# Altium schematic sheet BOOT_JTAG_AUX.SchDoc: =project_title
size Tabloid; CompanyName: Luxonis Holding; Organization: Luxonis Holding; Address1: 1925 Harmony Park Drive; Address2: Westminster, CO; Address3: 80234; Address4: United States; SheetNumber: 9; SheetTotal: 12
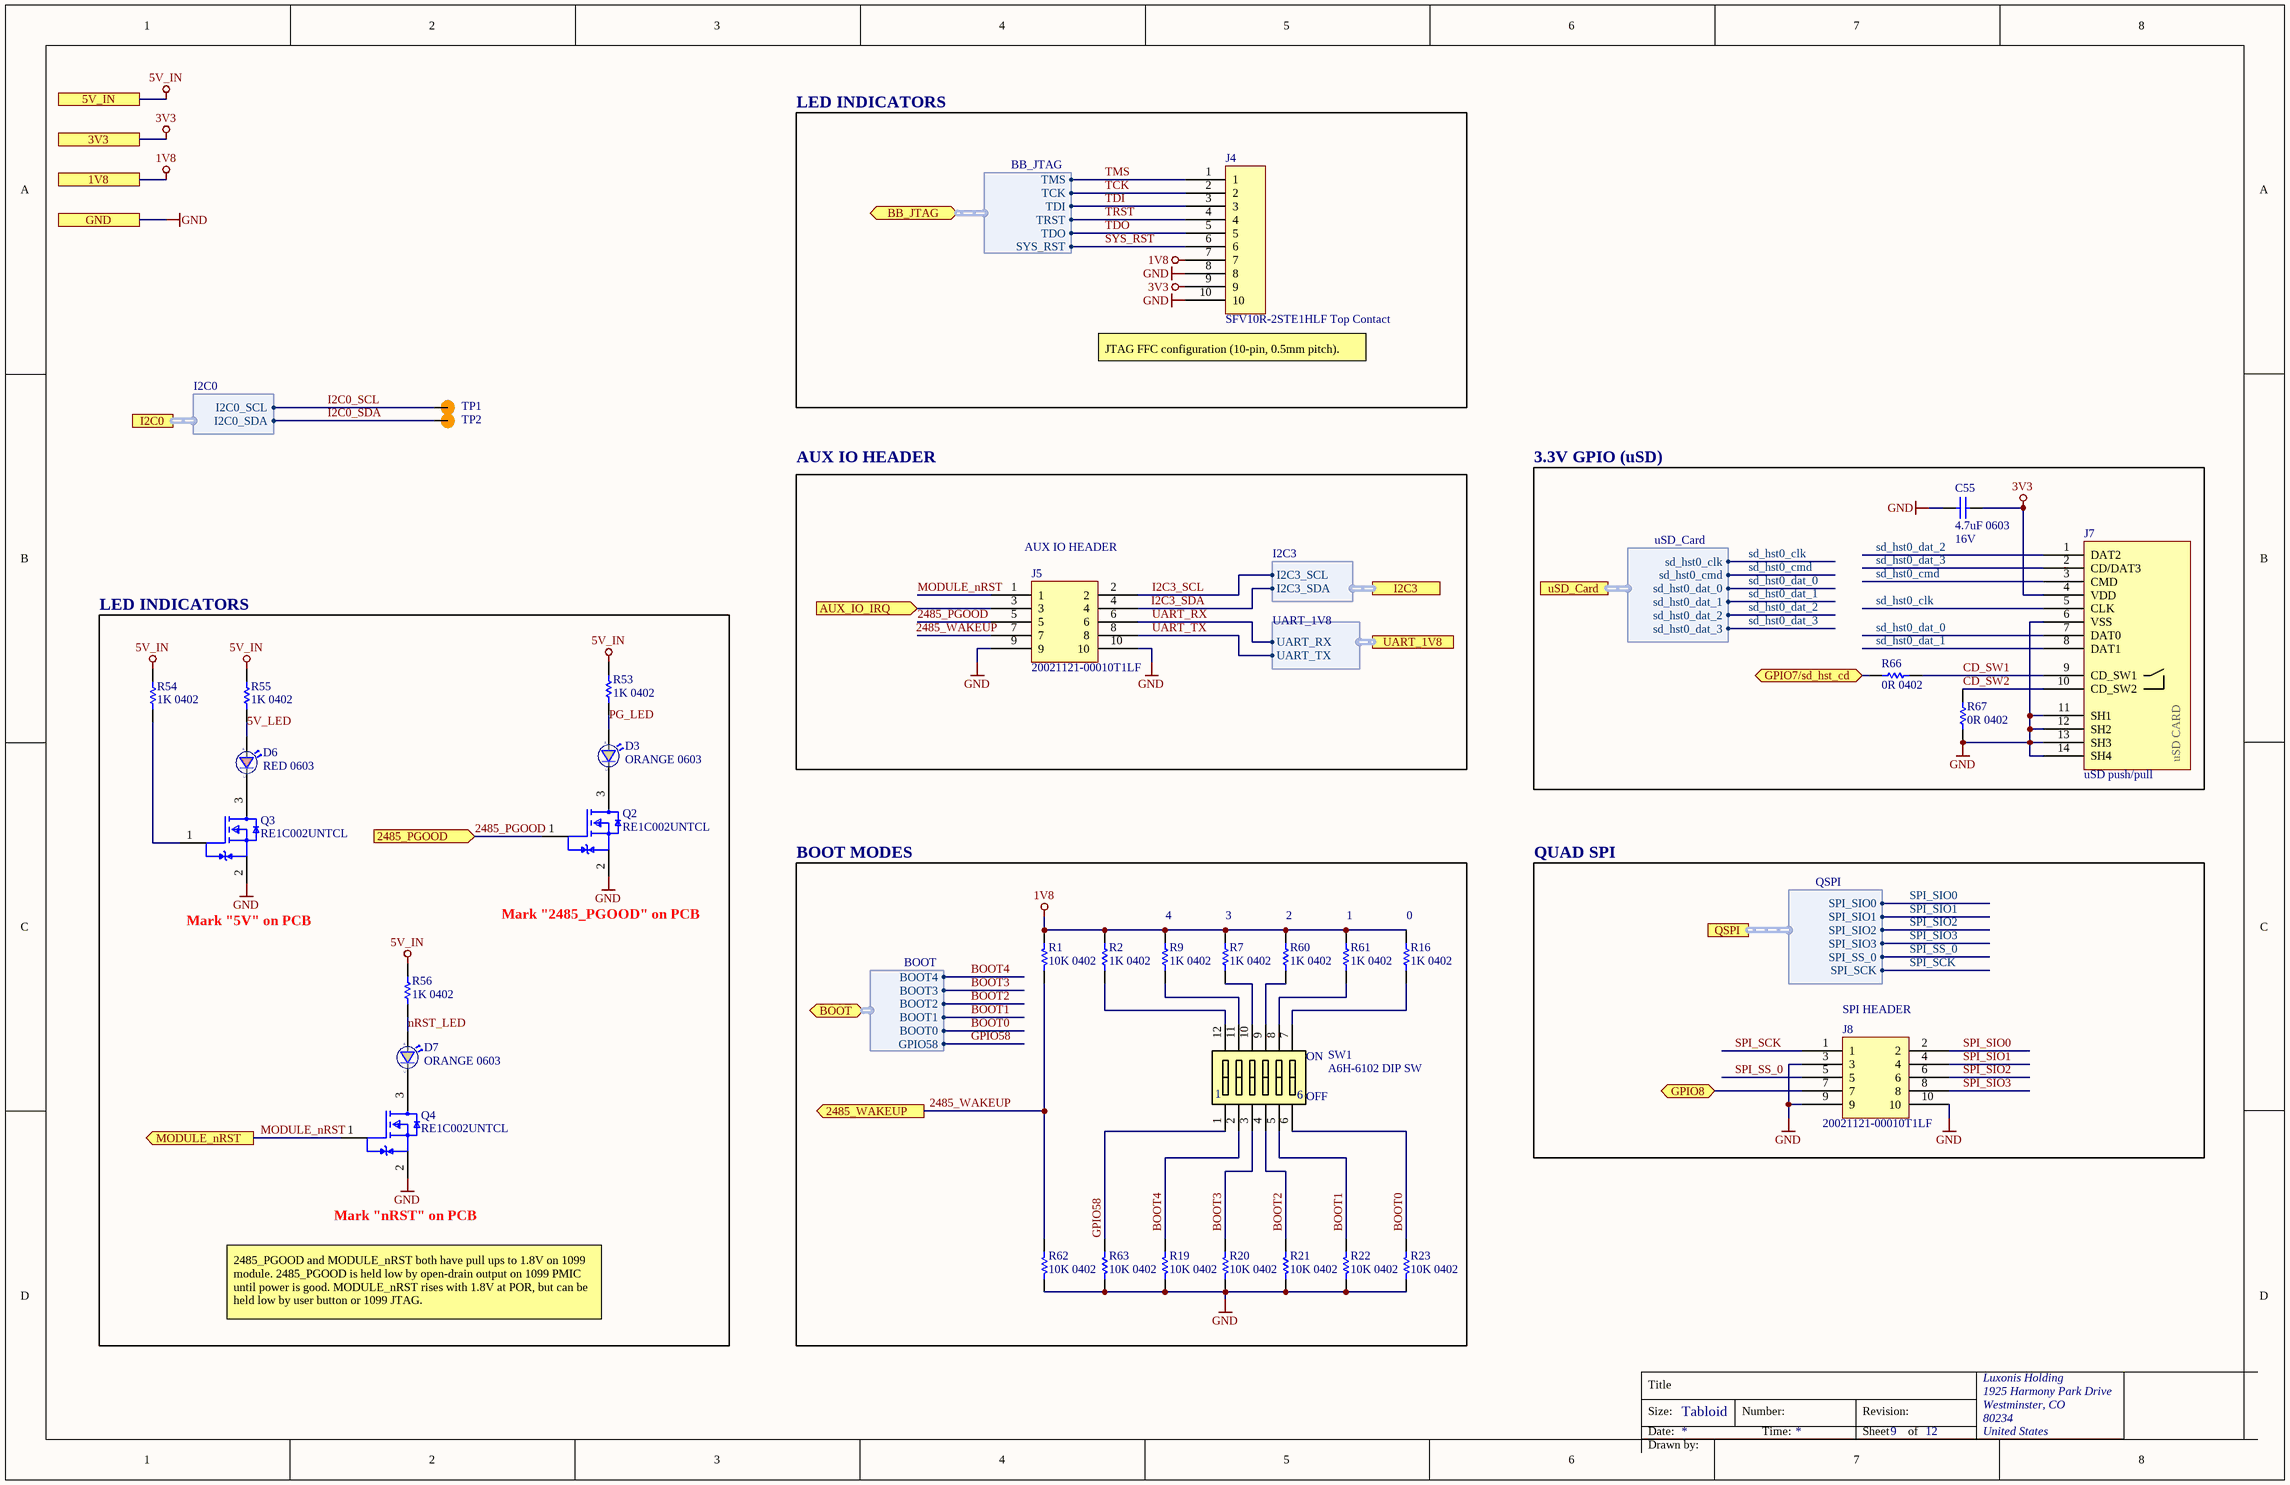
[diagram p0: BOOT_JTAG_AUX.SchDoc]

## Parts
C55  4.7uF 0603  Voltage Rating: 16V  [CAPC0603(1608)100_N]
D3  ORANGE 0603  [SML_D1xx8W]
D6  RED 0603  [SML_D1xx8W]
D7  ORANGE 0603  [SML_D1xx8W]
J4  SFV10R-2STE1HLF Top Contact  [SFV10R-2STE1HLF]
J5  20021121-00010T1LF  [20021121-00010T1LF]
J7  uSD push/pull  [104031-0811]
J8  20021121-00010T1LF  [20021121-00010T1LF]
Q2  RE1C002UNTCL  [RE1C002UNTCL]
Q3  RE1C002UNTCL  [RE1C002UNTCL]
Q4  RE1C002UNTCL  [RE1C002UNTCL]
R1  10K 0402  [RESC0402(1005)_N]
R2  1K 0402  [RESC0402(1005)_N]
R7  1K 0402  [RESC0402(1005)_N]
R9  1K 0402  [RESC0402(1005)_N]
R16  1K 0402  [RESC0402(1005)_N]
R19  10K 0402  [RESC0402(1005)_N]
R20  10K 0402  [RESC0402(1005)_N]
R21  10K 0402  [RESC0402(1005)_N]
R22  10K 0402  [RESC0402(1005)_N]
R23  10K 0402  [RESC0402(1005)_N]
R53  1K 0402  [RESC0402(1005)_N]
R54  1K 0402  [RESC0402(1005)_N]
R55  1K 0402  [RESC0402(1005)_N]
R56  1K 0402  [RESC0402(1005)_N]
R60  1K 0402  [RESC0402(1005)_N]
R61  1K 0402  [RESC0402(1005)_N]
R62  10K 0402  [RESC0402(1005)_N]
R63  10K 0402  [RESC0402(1005)_N]
R66  0R 0402  [RESC0402(1005)_N]
R67  0R 0402  [RESC0402(1005)_N]
SW1  A6H-6102 DIP SW  [A6H-610x]
TP1  TP100_200_NS  [TP100_200_NS]  (value not drawn)  (no BOM)
TP2  TP100_200_NS  [TP100_200_NS]  (value not drawn)  (no BOM)

## Blocks framed on the sheet
LED INDICATORS: J4
AUX IO HEADER: J5
3.3V GPIO (uSD): C55 J7 R66 R67
LED INDICATORS: D3 D6 D7 Q2-Q4 R53-R56
BOOT MODES: R1 R2 R7 R9 R16 R19-R23 R60-R63 SW1
QUAD SPI: J8

## Ports
1V8, 3V3, 5V_IN, 2485_PGOOD (in), 2485_WAKEUP (out), AUX_IO_IRQ (in), BB_JTAG (bidir, harness BB_JTAG), BOOT (bidir, harness BOOT), GND, GPIO7/sd_hst_cd (bidir), GPIO8 (bidir), I2C0 (harness I2C0), I2C3 (harness I2C3), MODULE_nRST (out), QSPI (harness QSPI), UART_1V8 (harness UART_1V8), uSD_Card (harness uSD_Card)

## Harnesses
BOOT: BOOT4, BOOT3, BOOT2, BOOT1, BOOT0, GPIO58
BB_JTAG: TMS, TCK, TDI, TRST, TDO, SYS_RST
I2C3: I2C3_SDA, I2C3_SCL
QSPI: SPI_SCK, SPI_SIO0, SPI_SIO1, SPI_SIO2, SPI_SIO3, SPI_SS_0
uSD_Card: sd_hst0_clk, sd_hst0_cmd, sd_hst0_dat_0, sd_hst0_dat_1, sd_hst0_dat_2, sd_hst0_dat_3
UART_1V8: UART_RX, UART_TX
I2C0: I2C0_SDA, I2C0_SCL

## Nets
1V8: J4.7 R1.1 R2.2 R7.2 R9.2 R16.2 R60.2 R61.2 ; port 1V8
3V3: C55.2 J4.9 J7.4(VDD) ; port 3V3
5V_IN: R53.2 R54.2 R55.2 R56.2 ; port 5V_IN
GND: C55.1 J4.8 J4.10 J5.9 J5.10 J7.6(VSS) J7.11(SH1) J7.12(SH2) J7.13(SH3) J7.14(SH4) J8.3 J8.9 J8.10 Q2.2(Source) Q3.2(Source) Q4.2(Source) R19.2 R20.2 R21.2 R22.2 R23.2 R62.2 R63.2 R67.1 ; port GND
5V_LED: D6.2(A) R55.1
2485_PGOOD: J5.5 Q2.1(Gate) ; port 2485_PGOOD
2485_WAKEUP: R1.2 R62.1 ; port 2485_WAKEUP
AUX_IO_IRQ: J5.3 ; port AUX_IO_IRQ
BOOT0: R23.1 SW1.6 ; port BOOT.BOOT0
BOOT1: R22.1 SW1.5 ; port BOOT.BOOT1
BOOT2: R21.1 SW1.4 ; port BOOT.BOOT2
BOOT3: R20.1 SW1.3 ; port BOOT.BOOT3
BOOT4: R19.1 SW1.2 ; port BOOT.BOOT4
CD_SW1: J7.9(CD_SW1) R66.1
CD_SW2: J7.10(CD_SW2) R67.2
GPIO7/sd_hst_cd: R66.2 ; port GPIO7/sd_hst_cd
GPIO8: J8.7 ; port GPIO8
GPIO58: R63.1 SW1.1 ; port BOOT.GPIO58
I2C0_SCL: TP1.1 ; port I2C0.I2C0_SCL
I2C0_SDA: TP2.1 ; port I2C0.I2C0_SDA
I2C3_SCL: J5.2 ; port I2C3.I2C3_SCL
I2C3_SDA: J5.4 ; port I2C3.I2C3_SDA
MODULE_nRST: J5.1 Q4.1(Gate) ; port MODULE_nRST
nRST_LED: D7.2(A) R56.1
PG_LED: D3.2(A) R53.1
sd_hst0_clk: J7.5(CLK) ; port uSD_Card.sd_hst0_clk
sd_hst0_cmd: J7.3(CMD) ; port uSD_Card.sd_hst0_cmd
sd_hst0_dat_0: J7.7(DAT0) ; port uSD_Card.sd_hst0_dat_0
sd_hst0_dat_1: J7.8(DAT1) ; port uSD_Card.sd_hst0_dat_1
sd_hst0_dat_2: J7.1(DAT2) ; port uSD_Card.sd_hst0_dat_2
sd_hst0_dat_3: J7.2(CD/DAT3) ; port uSD_Card.sd_hst0_dat_3
SPI_SCK: J8.1 ; port QSPI.SPI_SCK
SPI_SIO0: J8.2 ; port QSPI.SPI_SIO0
SPI_SIO1: J8.4 ; port QSPI.SPI_SIO1
SPI_SIO2: J8.6 ; port QSPI.SPI_SIO2
SPI_SIO3: J8.8 ; port QSPI.SPI_SIO3
SPI_SS_0: J8.5 ; port QSPI.SPI_SS_0
SYS_RST: J4.6 ; port BB_JTAG.SYS_RST
TCK: J4.2 ; port BB_JTAG.TCK
TDI: J4.3 ; port BB_JTAG.TDI
TDO: J4.5 ; port BB_JTAG.TDO
TMS: J4.1 ; port BB_JTAG.TMS
TRST: J4.4 ; port BB_JTAG.TRST
UART_RX: J5.6 ; port UART_1V8.UART_RX
UART_TX: J5.8 ; port UART_1V8.UART_TX
NetD3_1: D3.1(C) Q2.3(Drain)
NetD6_1: D6.1(C) Q3.3(Drain)
NetD7_1: D7.1(C) Q4.3(Drain)
NetQ3_1: Q3.1(Gate) R54.1
NetR2_1: R2.1 SW1.12
NetR7_1: R7.1 SW1.10
NetR9_1: R9.1 SW1.11
NetR16_1: R16.1 SW1.7
NetR60_1: R60.1 SW1.9
NetR61_1: R61.1 SW1.8

Not connected (* = marked no-connect by the designer): J5 7

## Notes on the sheet
- (near J4) JTAG FFC configuration (10-pin, 0.5mm pitch).
- (near J5) AUX IO HEADER
- Mark "5V" on PCB
- Mark "2485_PGOOD" on PCB
- (near R9) 4
- (near R7) 3
- (near R60) 2
- (near R61) 1
- (near R16) 0
- (near J8) SPI HEADER
- Mark "nRST" on PCB
- 2485_PGOOD and MODULE_nRST both have pull ups to 1.8V on 1099 module. 2485_PGOOD is held low by open-drain output on 1099 PMIC until power is good. MODULE_nRST rises with 1.8V at POR, but can be held low by user button or 1099 JTAG.
- Labels drawn without touching a wire or pin: 2485_WAKEUP
- Title
- Size:
- Date:
- Tabloid
- Number:
- Time:
- Revision:
- Sheet
- of
- Drawn by:
- (in symbol 104031-0811) uSD CARD
- (in symbol A6H-6102) ON; OFF

## Library data of the parts
C55 = GRM188R61C475KAAJD: CAP CER 4.7UF 16V X5R 0603 10%; Manufacturer 1: Murata; Material: Ceramic; Manufacturer Part Number 1: GRM188R61C475KAAJD; Supplier 1: Digi-Key; Stock 1: 455058; Pricing 1: 1=0.35000, 10=0.24600, 100=0.14730, 500=0.11050, 1000=0.09331 (USD); RoHS: Yes; Mount: Surface Mount; Case/Package: 0603; Weight: 0.000222oz; Case Code (Metric): 1608; Case Code (Imperial): 0603; Min Operating Temperature: -55°C; Max Operating Temperature: 85°C; Capacitance: 4.7uF; Tolerance: 10%; Packaging: Tape and Reel; Dielectric: X5R; Termination: SMD/SMT; Voltage Rating (DC): 16V; Package Quantity: 4000; Length: 1.6mm; Height: 0.8mm; Width: 0.8mm; Thickness: 0.037inch; Depth: 0.8mm; REACH SVHC: No SVHC; Lead Free: Lead Free; ComponentLink1URL: https://datasheet.ciiva.com/14813/595grm188r61c475kaaj23-14813668.pdf?src-supplier=Arrow; ComponentLink1Description: https://datasheet.ciiva.com/14813/595grm188r61c475kaaj23-14813668.pdf?src-supplier=Arrow; Supplier 2: Digi-Key; Manufacturer 2: Murata; Manufacturer Part Number 2: GRM188R61C475KAAJD; Stock 2: 455058; Pricing 2: 1=0.35000, 10=0.24600, 100=0.14730, 500=0.11050, 1000=0.09331 (USD); Supplier 3: Digi-Key; Manufacturer 3: Murata; Manufacturer Part Number 3: GRM188R61C475KAAJD; Stock 3: 452000; Pricing 3: 4000=0.07259, 8000=0.06832, 12000=0.06619, 28000=0.06405 (USD); Supplier Part Number 1: 490-10481-1-ND; Supplier Part Number 2: 490-10481-6-ND; Supplier Part Number 3: 490-10481-2-ND
D3 D7 = SML-D12D8WT86: LED ORANGE DIFFUSED 0603 SMD Orange 605nm LED Indication - Discrete 2.2V 0603 (1608 Metric); Manufacturer 1: Rohm; Lens Color: White; Lens Style: Diffused,Colorless,Rectangular; Number of LEDs: 1; Viewing Angle: 160°; Forward Current: 20mA; Luminous Intensity: 100mcd; Supplier 1: Digi-Key; Stock 1: 29355; Pricing 1: 1=0.33000, 10=0.23900, 100=0.11340, 500=0.07560, 1000=0.05922 (USD); RoHS: Yes; Mount: Surface Mount; Case/Package: 0603; Number of Pins: 2; Color: Orange; Case Code (Metric): 1608; Case Code (Imperial): 0603; Min Operating Temperature: -40°C; Max Operating Temperature: 85°C; Dominant Wavelength: 605nm; Forward Voltage: 2.2V; Package Quantity: 1; Packaging: Tape and Reel; Illumination Color: Orange; Test Current: 20mA; Lens Transparency: Diffused; Wavelength: 605nm; Length: 1.6mm; Height: 0.65mm; Width: 0.8mm; Radiation Hardening: No; REACH SVHC: Unknown; Lead Free: Lead Free; ComponentLink1URL: https://datasheet.ciiva.com/2115/sml-d1-2115577.pdf?src-supplier=Digi-Key; ComponentLink1Description: https://datasheet.ciiva.com/2115/sml-d1-2115577.pdf?src-supplier=Digi-Key; ComponentLink2URL: https://datasheet.ciiva.com/2115/sml-d1-2115578.pdf?src-supplier=Digi-Key; ComponentLink2Description: https://datasheet.ciiva.com/2115/sml-d1-2115578.pdf?src-supplier=Digi-Key; ComponentLink3URL: https://datasheet.ciiva.com/3161/sml-d1-3161418.pdf?src-supplier=Avnet; ComponentLink3Description: https://datasheet.ciiva.com/3161/sml-d1-3161418.pdf?src-supplier=Avnet; ComponentLink4URL: https://datasheet.ciiva.com/16387/sml-d1-16387850.pdf?src-supplier=Future+Electronics; ComponentLink4Description: https://datasheet.ciiva.com/16387/sml-d1-16387850.pdf?src-supplier=Future+Electronics; ComponentLink5URL: https://datasheet.ciiva.com/2115/sml-d1-2115579.pdf?src-supplier=Digi-Key; ComponentLink5Description: https://datasheet.ciiva.com/2115/sml-d1-2115579.pdf?src-supplier=Digi-Key; ComponentLink6URL: https://datasheet.ciiva.com/17419/sml-d1-17419886.pdf?src-supplier=Avnet+Europe; ComponentLink6Description: https://datasheet.ciiva.com/17419/sml-d1-17419886.pdf?src-supplier=Avnet+Europe; Supplier Part Number 1: 511-1577-1-ND; Manufacturer Part Number 1: SML-D12D8WT86
D6 = SML-D12U8WT86: LED RED DIFFUSED 0603 SMD Red 620nm LED Indication - Discrete 2.2V 0603 (1608 Metric); Manufacturer 1: Rohm; Lens Color: White,Clear,Diffused; Lens Style: Rectangular,Diffused,Colorless; Forward Current: 20mA; Luminous Intensity: 63mcd; Number of LEDs: 1; Viewing Angle: 160°; RoHS: Yes; Mount: Surface Mount; Case/Package: 0603; Number of Pins: 2; Color: Red; Case Code (Metric): 1608; Case Code (Imperial): 0603; Min Operating Temperature: -40°C; Max Operating Temperature: 85°C; Forward Voltage: 2.2V; Packaging: Tape and Reel; Dominant Wavelength: 620nm; Wavelength: 620nm; Package Quantity: 1; Illumination Color: Red; Test Current: 20mA; Lens Transparency: Diffused; Length: 1.6mm; Height: 0.65mm; Width: 0.8mm; Radiation Hardening: No; REACH SVHC: No SVHC; Lead Free: Lead Free; ComponentLink1URL: https://datasheet.ciiva.com/11774/0900766b80df3ada-11774020.pdf?src-supplier=RSComponents; ComponentLink1Description: https://datasheet.ciiva.com/11774/0900766b80df3ada-11774020.pdf?src-supplier=RSComponents; ComponentLink2URL: https://datasheet.ciiva.com/2110/sml-d1-2110375.pdf?src-supplier=Digi-Key; ComponentLink2Description: https://datasheet.ciiva.com/2110/sml-d1-2110375.pdf?src-supplier=Digi-Key; ComponentLink3URL: https://datasheet.ciiva.com/2110/sml-d1-2110376.pdf?src-supplier=Digi-Key; ComponentLink3Description: https://datasheet.ciiva.com/2110/sml-d1-2110376.pdf?src-supplier=Digi-Key; ComponentLink4URL: https://datasheet.ciiva.com/2110/sml-d1-2110377.pdf?src-supplier=Digi-Key; ComponentLink4Description: https://datasheet.ciiva.com/2110/sml-d1-2110377.pdf?src-supplier=Digi-Key; ComponentLink5URL: https://datasheet.ciiva.com/9324/sml-d1-9324826.pdf?src-supplier=Avnet; ComponentLink5Description: https://datasheet.ciiva.com/9324/sml-d1-9324826.pdf?src-supplier=Avnet; ComponentLink6URL: https://datasheet.ciiva.com/17420/sml-d1-17420939.pdf?src-supplier=Avnet+Europe; ComponentLink6Description: https://datasheet.ciiva.com/17420/sml-d1-17420939.pdf?src-supplier=Avnet+Europe; Supplier 1: Digi-Key; Manufacturer Part Number 1: SML-D12U8WT86; Stock 1: 63748; Pricing 1: 1=0.33000, 10=0.23900, 100=0.11340, 500=0.07560, 1000=0.05922 (USD); Supplier Part Number 1: 511-1580-1-ND
J4 = SFV10R-2STE1HLF: CONN FFC TOP 10POS 0.50MM R/A; Manufacturer 1: Amphenol FCI; Actuator Material: Glass,Polyphenylene; Number of Contacts: 10; Current Rating: 500mA; Voltage Rating: 50V; Contact Resistance: 30mR; Insulation Resistance: 100MR; Gender: Female; Wire/Cable Type: Straight; Pitch: 0.5mm; System: Connector; Supplier 1: Digi-Key; Manufacturer Part Number 1: SFV10R-2STE1HLF; Stock 1: 78727; Pricing 1: 1=0.63000, 10=0.59300, 25=0.53360, 50=0.47420, 100=0.45440, 250=0.41488, 500=0.39512, 1000=0.32597 (USD); RoHS: Yes; Mount: Surface Mount; Contact Material: Bronze; Contact Plating: Tin; Housing Color: Black; Housing Material: Polyamide; Min Operating Temperature: -55°C; Max Operating Temperature: 105°C; Number of Rows: 1; Termination: Solder; Orientation: Right Angle; Package Quantity: 1; Packaging: Tape and Reel; Contact Location: Top; Number of Positions: 10; Max Voltage Rating (AC): 50V; Max Voltage Rating (DC): 50V; Length: 10.5mm; Depth: 4.9mm; Radiation Hardening: No; Lead Free: Lead Free; Flammability Rating: UL94 V-0; ComponentLink1URL: https://datasheet.ciiva.com/672/10112793-672039.pdf?src-supplier=Digi-Key; ComponentLink1Description: https://datasheet.ciiva.com/672/10112793-672039.pdf?src-supplier=Digi-Key; ComponentLink2URL: https://datasheet.ciiva.com/672/10112793-672040.pdf?src-supplier=Digi-Key; ComponentLink2Description: https://datasheet.ciiva.com/672/10112793-672040.pdf?src-supplier=Digi-Key; ComponentLink3URL: https://datasheet.ciiva.com/672/10112793-672041.pdf?src-supplier=Digi-Key; ComponentLink3Description: https://datasheet.ciiva.com/672/10112793-672041.pdf?src-supplier=Digi-Key; ComponentLink4URL: https://datasheet.ciiva.com/10368/10112793-10368361.pdf?src-supplier=Avnet; ComponentLink4Description: https://datasheet.ciiva.com/10368/10112793-10368361.pdf?src-supplier=Avnet; Supplier Part Number 1: 609-4306-1-ND; Supplier 2: Mouser; Supplier Part Number 2: 649-SFV10R-2STE1HLF
J5 J8 = 20021121-00010T1LF: CONN HEADER SMD 10POS 1.27MM; Manufacturer 1: Amphenol FCI; Number of Contacts: 10; Contact Resistance: 30mR; Max Voltage Rating (AC): 125V; Connector Type: Male Pin; Row Spacing: 0.05inch; Supplier 1: Digi-Key; Manufacturer Part Number 1: 20021121-00010T1LF; Stock 1: 1465; Pricing 1: 1=0.77000, 10=0.71800, 100=0.55040, 500=0.47860, 1000=0.39485, 5000=0.34699, 10000=0.32306 (USD); RoHS: Yes; Mount: Surface Mount; Contact Plating: Gold; Color: Black; Contact Material: Copper Alloy; Housing Color: Black; Housing Material: Thermoplastic; Min Operating Temperature: -40°C; Max Operating Temperature: 85°C; Number of Rows: 2; Termination: Solder; Package Quantity: 93; Packaging: Rail/Tube; Number of Positions: 10; Orientation: Straight; Length: 6.35mm; Pitch: 1.27mm; Contact Mating Length: 0.12inch; Depth: 3.4mm; ComponentLink1URL: https://datasheet.ciiva.com/18659/20021121-18659066.pdf?src-supplier=Digi-Key; ComponentLink1Description: https://datasheet.ciiva.com/18659/20021121-18659066.pdf?src-supplier=Digi-Key; ComponentLink2URL: https://datasheet.ciiva.com/10033/20021121-10033582.pdf?src-supplier=Avnet; ComponentLink2Description: https://datasheet.ciiva.com/10033/20021121-10033582.pdf?src-supplier=Avnet; Supplier Part Number 1: 609-6529-ND; Supplier 2: Mouser; Supplier 3: TTI; Supplier Part Number 2: 649-200211210010T1LF; Supplier Part Number 3: 20021121-00010T1LF
J7 = 104031-0811: CONN MICRO SD CARD PUSH-PULL R/A; Manufacturer 1: Molex; Manufacturer Part Number 1: 104031-0811; Supplier 1: Digi-Key; Stock 1: 19400; Pricing 1: 1=2.02000, 10=1.82900, 25=1.71680, 50=1.64220, 100=1.56760, 250=1.41828, 500=1.30630, 1000=1.11969 (USD); RoHS: No; Supplier 2: Newark; Supplier 3: Mouser; Supplier Part Number 1: WM6357CT-ND; Supplier Part Number 2: 99R5410; Supplier Part Number 3: 538-104031-0811
Q2-Q4 = RE1C002UNTCL: MOSFET N-CH 20V 0.2A EMT3; Manufacturer 1: Rohm; Continuous Drain Current (ID): 200mA; Rds On Max: 1.2R; Input Capacitance: 25pF; Max Power Dissipation: 150mW; RoHS: Yes; Mount: Surface Mount; Case/Package: SOT-89; Packaging: Tape and Reel; Drain to Source Voltage (Vdss): 20V; Lead Free: Lead Free; ComponentLink1URL: http://www.mouser.com/ds/2/348/re1c002untcl-e-1018231.pdf?src-supplier=Mouser; ComponentLink1Description: http://www.mouser.com/ds/2/348/re1c002untcl-e-1018231.pdf?src-supplier=Mouser; ComponentLink2URL: http://rohmfs.rohm.com/en/techdata_basic/transistor/taping/EMT3_TL_taping.pdf?src-supplier=Digi-Key; ComponentLink2Description: http://rohmfs.rohm.com/en/techdata_basic/transistor/taping/EMT3_TL_taping.pdf?src-supplier=Digi-Key; ComponentLink3URL: http://rohmfs.rohm.com/en/products/databook/datasheet/discrete/transistor/mosfet/re1c002un.pdf?src-supplier=Avnet; ComponentLink3Description: http://rohmfs.rohm.com/en/products/databook/datasheet/discrete/transistor/mosfet/re1c002un.pdf?src-supplier=Avnet; ComponentLink4URL: https://www.rohm.com/datasheet/RE1C002UN/re1c002untcl-e?src-supplier=Digi-Key; ComponentLink4Description: https://www.rohm.com/datasheet/RE1C002UN/re1c002untcl-e?src-supplier=Digi-Key; ComponentLink5URL: http://www.farnell.com/datasheets/2704376.pdf?src-supplier=Newark; ComponentLink5Description: http://www.farnell.com/datasheets/2704376.pdf?src-supplier=Newark; ComponentLink6URL: http://www.farnell.com/datasheets/2704376.pdf?src-supplier=Farnell; ComponentLink6Description: http://www.farnell.com/datasheets/2704376.pdf?src-supplier=Farnell; ComponentLink7URL: http://www.farnell.com/datasheets/2704376.pdf?src-supplier=Element14; ComponentLink7Description: http://www.farnell.com/datasheets/2704376.pdf?src-supplier=Element14; Supplier 1: Digi-Key; Manufacturer Part Number 1: RE1C002UNTCL; Stock 1: 868886; Pricing 1: 1=0.20000, 10=0.18200, 100=0.09930, 500=0.06112, 1000=0.04167 (USD); Supplier Part Number 1: RE1C002UNTCLCT-ND
R1 R19-R23 R62 R63 = RC0402FR-1310KL: RES SMD 10K OHM 1% 0402 1/16W Chip Resistor, 0402 [1005 Metric], 10 kohm, RC Series, 50 V, Thick Film, 62.5 mW; Manufacturer 1: Yageo; Resistance: 10kR; Temperature Coefficient: 100ppm/°C; Power Rating: 62.5mW; Voltage Rating: 50V; ComponentLink1URL: https://datasheet.ciiva.com/16940/pyu-rc0402-51-rohs-l-6-16940293.pdf?src-supplier=Avnet+Europe; ComponentLink1Description: https://datasheet.ciiva.com/16940/pyu-rc0402-51-rohs-l-6-16940293.pdf?src-supplier=Avnet+Europe; ComponentLink2URL: https://datasheet.ciiva.com/28386/pyu-rc0402-51-rohs-l-6-28386855.pdf?src-supplier=Avnet+Europe; ComponentLink2Description: https://datasheet.ciiva.com/28386/pyu-rc0402-51-rohs-l-6-28386855.pdf?src-supplier=Avnet+Europe; ComponentLink3URL: https://datasheet.ciiva.com/16740/pyu-rc0402-51-rohs-l-6-r-16740602.pdf?src-supplier=Future+Electronics; ComponentLink3Description: https://datasheet.ciiva.com/16740/pyu-rc0402-51-rohs-l-6-r-16740602.pdf?src-supplier=Future+Electronics; ComponentLink4URL: https://datasheet.ciiva.com/8891/pyu-rc0402-51-rohs-l-6-8891339.pdf?src-supplier=Avnet; ComponentLink4Description: https://datasheet.ciiva.com/8891/pyu-rc0402-51-rohs-l-6-8891339.pdf?src-supplier=Avnet; ComponentLink5URL: https://datasheet.ciiva.com/5557/pyu-rc0402-51-rohs-l-6-r-5557997.pdf?src-supplier=Mouser; ComponentLink5Description: https://datasheet.ciiva.com/5557/pyu-rc0402-51-rohs-l-6-r-5557997.pdf?src-supplier=Mouser; ComponentLink6URL: https://datasheet.ciiva.com/7983/1018594-7983533.pdf?src-supplier=Element14; ComponentLink6Description: https://datasheet.ciiva.com/7983/1018594-7983533.pdf?src-supplier=Element14; Supplier 1: Newark; Manufacturer Part Number 1: RC0402FR-1310KL; Stock 1: 62239; Pricing 1: 1=0.10000, 25=0.01200, 100=0.00400, 250=0.00400, 500=0.00300, 1000=0.00300 (USD); RoHS: Yes; Case/Package: 0402; Number of Pins: 2; Contact Plating: Tin,Matte,Lead; Case Code (Imperial): 0402; Case Code (Metric): 1005; Min Operating Temperature: -55°C; Max Operating Temperature: 155°C; Tolerance: 1%; Composition: Thick Film; Packaging: Tape and Reel; Termination: SMD/SMT; Military Standard: Not; Voltage Rating (DC): 50V; Working Voltage: 50V; Number of Terminations: 2; Length: 1mm; Depth: 0.5mm; Radiation Hardening: No; REACH SVHC: No SVHC; Lead Free: Lead Free; Supplier Part Number 1: 67R9960
R2 R7 R9 R16 R53-R56 R60 R61 = RC0402FR-071KL: RES SMD 1K OHM 1% 1/16W 0402 1 kOhms ±1% 0.063W, 1/16W Chip Resistor 0402 (1005 Metric) Moisture Resistant Thick Film; Manufacturer 1: Yageo; Temperature Coefficient: 100ppm/°C; Power Rating: 62.5mW; Voltage Rating (DC): 50V; Resistance: 1kR; RoHS: Yes; Number of Pins: 2; Case Code (Imperial): 0402; Case Code (Metric): 1005; Min Operating Temperature: -55°C; Max Operating Temperature: 155°C; Packaging: Tape and Reel; Composition: Thick Film; Voltage Rating: 50V; Military Standard: Not; Termination: SMD/SMT; Length: 1mm; Height: 0.32mm; Width: 0.5mm; Depth: 0.5mm; Lead Free: Lead Free; REACH SVHC: Unknown; ComponentLink1URL: https://datasheet.ciiva.com/11819/0900766b80c66297-11819477.pdf?src-supplier=RSComponents; ComponentLink1Description: https://datasheet.ciiva.com/11819/0900766b80c66297-11819477.pdf?src-supplier=RSComponents; ComponentLink2URL: https://datasheet.ciiva.com/12666/pyu-rc0402-51-rohs-l-6-r-12666741.pdf?src-supplier=Mouser; ComponentLink2Description: https://datasheet.ciiva.com/12666/pyu-rc0402-51-rohs-l-6-r-12666741.pdf?src-supplier=Mouser; ComponentLink3URL: https://datasheet.ciiva.com/17063/pyu-rc0402-51-rohs-l-6-r-17063193.pdf?src-supplier=Future+Electronics; ComponentLink3Description: https://datasheet.ciiva.com/17063/pyu-rc0402-51-rohs-l-6-r-17063193.pdf?src-supplier=Future+Electronics; ComponentLink4URL: https://datasheet.ciiva.com/22747/1018594-22747513.pdf?src-supplier=Element14; ComponentLink4Description: https://datasheet.ciiva.com/22747/1018594-22747513.pdf?src-supplier=Element14; ComponentLink5URL: https://datasheet.ciiva.com/7849/1018594-7849869.pdf?src-supplier=Element14; ComponentLink5Description: https://datasheet.ciiva.com/7849/1018594-7849869.pdf?src-supplier=Element14; ComponentLink6URL: https://datasheet.ciiva.com/7983/1018594-7983502.pdf?src-supplier=Element14; ComponentLink6Description: https://datasheet.ciiva.com/7983/1018594-7983502.pdf?src-supplier=Element14; ComponentLink7URL: https://datasheet.ciiva.com/7849/1018594-7849871.pdf?src-supplier=Element14; ComponentLink7Description: https://datasheet.ciiva.com/7849/1018594-7849871.pdf?src-supplier=Element14; Supplier 1: Digi-Key; Manufacturer Part Number 1: RC0402FR-071KL; Stock 1: 60695854; Pricing 1: 1=0.10000, 10=0.01600, 100=0.00670, 1000=0.00301, 2500=0.00261, 5000=0.00215 (USD); Case/Package: 0402; Tolerance: 1%; Supplier Part Number 1: 311-1.00KLRCT-ND
R66 R67 = CRCW04020000Z0ED: RES SMD 0 OHM JUMPER 1/16W 0402; Manufacturer 1: Vishay; Resistance: 0mR; Power Rating: 63mW; Voltage Rating: 50V; Temperature Coefficient: 100ppm/°C; Tolerance: 5%; Manufacturer Part Number 1: CRCW04020000Z0ED; Supplier 1: Digi-Key; Stock 1: 855968; Pricing 1: 1=0.10000, 10=0.03400, 25=0.02440, 50=0.01860, 100=0.01380, 250=0.01048, 500=0.00840, 1000=0.00618, 5000=0.00443 (USD); RoHS: Yes; Mount: Surface Mount; Case/Package: 0402; Weight: 2.3E-05oz; Case Code (Imperial): 0402; Case Code (Metric): 1005; Contact Plating: Tin; Min Operating Temperature: -55°C; Max Operating Temperature: 155°C; Packaging: Tape and Reel; Composition: Thick Film; Voltage Rating (DC): 50V; Package Quantity: 1; Termination: SMD/SMT; Number of Terminations: 2; Military Standard: Not; Max Power Dissipation: 63mW; Features: Automotive AEC-Q200; Length: 1mm; Height: 0.35mm; Width: 0.5mm; Depth: 0.5mm; Radiation Hardening: No; REACH SVHC: Unknown; Lead Free: Lead Free; ComponentLink1URL: https://datasheet.ciiva.com/3255/dcrcwe3-3255944.pdf?src-supplier=Avnet; ComponentLink1Description: https://datasheet.ciiva.com/3255/dcrcwe3-3255944.pdf?src-supplier=Avnet; ComponentLink2URL: https://datasheet.ciiva.com/3255/dcrcwe3-3255945.pdf?src-supplier=Avnet; ComponentLink2Description: https://datasheet.ciiva.com/3255/dcrcwe3-3255945.pdf?src-supplier=Avnet; ComponentLink3URL: https://datasheet.ciiva.com/16881/dcrcwe3-16881413.pdf?src-supplier=Avnet+Europe; ComponentLink3Description: https://datasheet.ciiva.com/16881/dcrcwe3-16881413.pdf?src-supplier=Avnet+Europe; ComponentLink4URL: https://datasheet.ciiva.com/2461/dcrcwe3-2461962.pdf?src-supplier=Digi-Key; ComponentLink4Description: https://datasheet.ciiva.com/2461/dcrcwe3-2461962.pdf?src-supplier=Digi-Key; ComponentLink5URL: https://datasheet.ciiva.com/7841/1720486-7841802.pdf?src-supplier=Element14; ComponentLink5Description: https://datasheet.ciiva.com/7841/1720486-7841802.pdf?src-supplier=Element14; ComponentLink6URL: https://datasheet.ciiva.com/2461/dcrcwe3-2461963.pdf?src-supplier=Digi-Key; ComponentLink6Description: https://datasheet.ciiva.com/2461/dcrcwe3-2461963.pdf?src-supplier=Digi-Key; ComponentLink7URL: https://datasheet.ciiva.com/2461/dcrcwe3-2461964.pdf?src-supplier=Digi-Key; ComponentLink7Description: https://datasheet.ciiva.com/2461/dcrcwe3-2461964.pdf?src-supplier=Digi-Key; ComponentLink8URL: https://datasheet.ciiva.com/7841/1697337-7841468.pdf?src-supplier=Element14; ComponentLink8Description: https://datasheet.ciiva.com/7841/1697337-7841468.pdf?src-supplier=Element14; ComponentLink9URL: https://datasheet.ciiva.com/16761/70200976-16761309.pdf?src-supplier=Allied+Electronics; ComponentLink9Description: https://datasheet.ciiva.com/16761/70200976-16761309.pdf?src-supplier=Allied+Electronics; ComponentLink10URL: https://datasheet.ciiva.com/26311/fld-crcw-e3-data-en-26311550.pdf?src-supplier=Distrelec; ComponentLink10Description: https://datasheet.ciiva.com/26311/fld-crcw-e3-data-en-26311550.pdf?src-supplier=Distrelec; Supplier Part Number 1: 541-0.0JCT-ND
SW1 = A6H-6102: SWITCH SLIDE DIP SPST 25MA 24V (SEALED); Manufacturer 1: Omron; Mechanical Life: 1000Cycles; Contact Resistance: 200mR; Number of Positions: 6; Actuator Type: Slide (Standard); Number of Poles: 4; Pitch: 0.05inch; Actuator Length: 0mm; Washable: Yes; Supplier 1: Digi-Key; Manufacturer Part Number 1: A6H-6102; Stock 1: 3953; Pricing 1: 1=2.66000, 10=2.57900, 25=2.44640, 50=2.28700, 100=2.23380, 250=1.91468, 500=1.86148, 1000=1.59555, 5000=1.46259 (USD); RoHS: Yes; Mount: Surface Mount; Case/Package: DIP; Weight: 0.12g; Min Operating Temperature: -20°C; Max Operating Temperature: 70°C; Voltage Rating (DC): 24V; Throw Configuration: SPST; Packaging: Rail/Tube; Max Current Rating: 25mA; Termination: Gull Wing; Orientation: Straight; Max Voltage Rating (DC): 24V; Current Rating: 25mA; Package Quantity: 54; Electrical Life: 1000Cycles; Number of Circuits: 6; Length: 0.348inch; Height: 1.55mm; Terminal Pitch: 1.27mm; Depth: 6.7mm; Width: 4.5mm; Radiation Hardening: No; REACH SVHC: Unknown; ComponentLink1URL: https://datasheet.ciiva.com/26883/getdatasheetpartid-744653-26883354.pdf?src-supplier=Verical; ComponentLink1Description: https://datasheet.ciiva.com/26883/getdatasheetpartid-744653-26883354.pdf?src-supplier=Verical; ComponentLink2URL: https://datasheet.ciiva.com/2864/a6h-1110-2864768.pdf?src-supplier=Digi-Key; ComponentLink2Description: https://datasheet.ciiva.com/2864/a6h-1110-2864768.pdf?src-supplier=Digi-Key; ComponentLink3URL: https://datasheet.ciiva.com/1529/611565-1529044.pdf?src-supplier=Element14; ComponentLink3Description: https://datasheet.ciiva.com/1529/611565-1529044.pdf?src-supplier=Element14; ComponentLink4URL: https://datasheet.ciiva.com/16198/a6h-1110-16198863.pdf?src-supplier=Onlinecomponents.com; ComponentLink4Description: https://datasheet.ciiva.com/16198/a6h-1110-16198863.pdf?src-supplier=Onlinecomponents.com; Supplier 2: Mouser; Supplier 3: Farnell; Supplier Part Number 2: 653-A6H-6102; Supplier Part Number 1: SW1117-ND; Supplier Part Number 3: 1829491
TP1 TP2 = TEST_POINT